# Altium project LT3790.PrjPcb
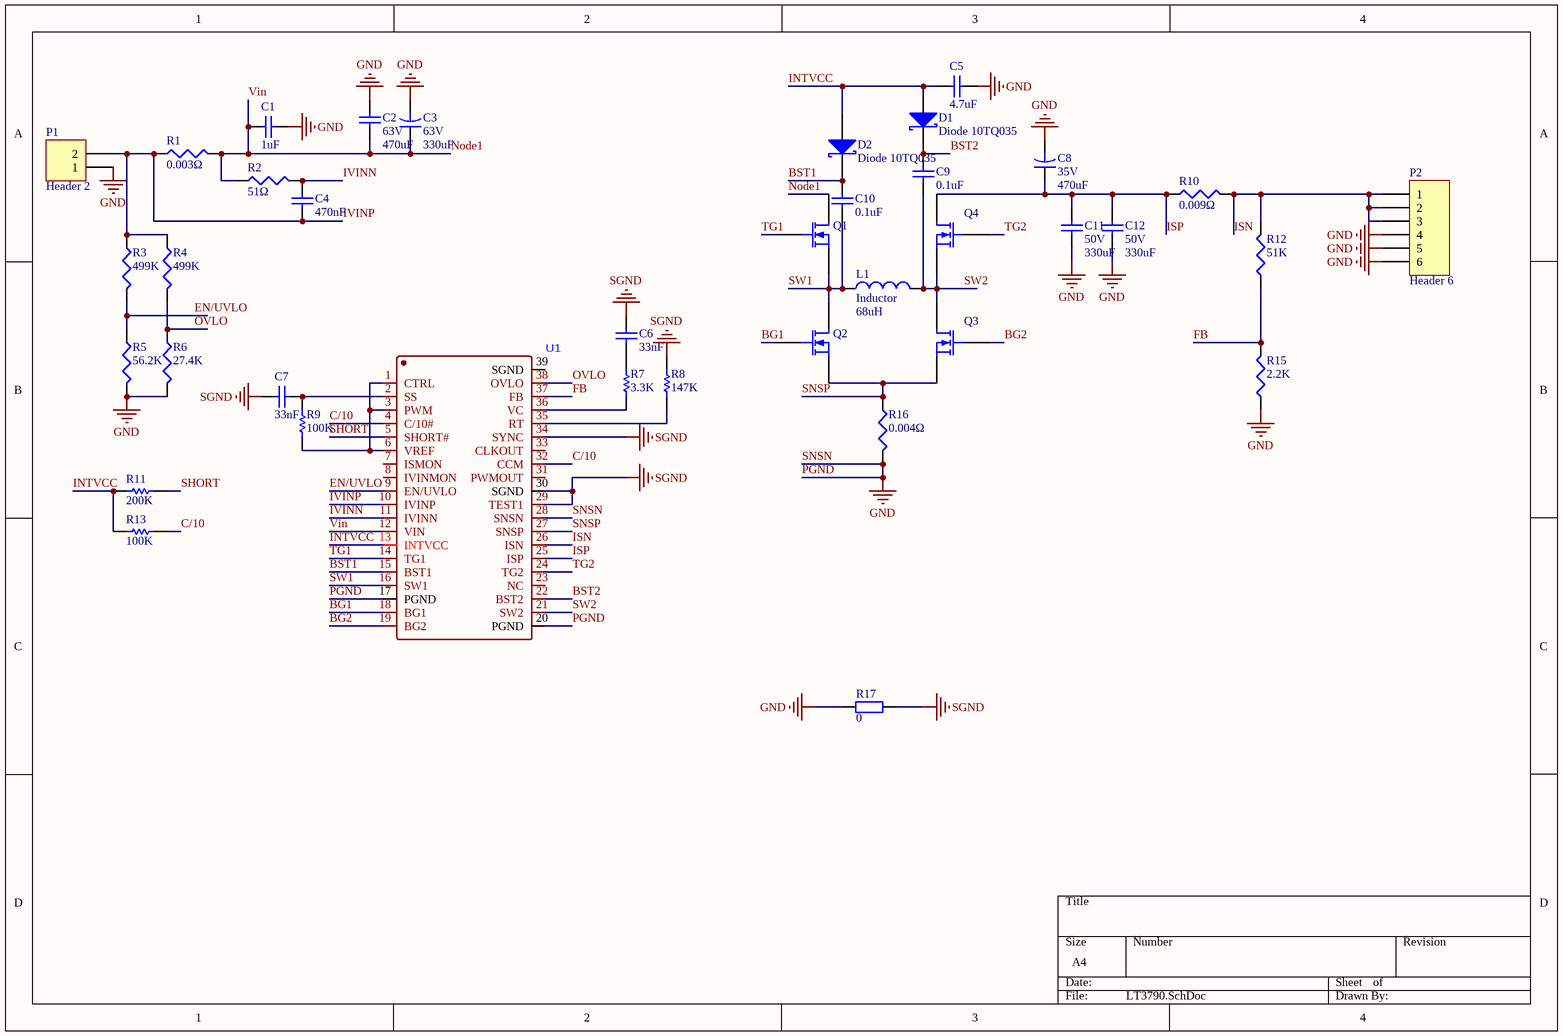
[diagram p0: LT3790.SchDoc]
1 sheet, 38 parts. Net scope: global (net labels, ports and power ports of the same name join across sheets).
Board file: LT3790.PcbDoc

## Sheet LT3790.SchDoc
size A4; SheetNumber: 1; SheetTotal: 1

### Parts
C1  1uF  [CAP0603]
C2  63V  value 470uF  [CAP-SMD_D16xl 16.5mm]
C3  63V  value 330uF  [CAP-SMD_D16xl 16.5mm]
C4  470nF  [cap0402]
C5  4.7uF  [CAP0603]
C6  33nF  [cap0402]
C7  33nF  [cap0402]
C8  35V  value 470uF  [SMD,D10xl10.5mm]
C9  0.1uF  [CAP0603]
C10  0.1uF  [CAP0603]
C11  50V  value 330uF  [CAP-SMD,D10xl10.5mm]
C12  50V  value 330uF  [CAP-SMD,D10xl10.5mm]
D1  Diode 10TQ035  [LED-SMB]
D2  Diode 10TQ035  [LED-SMB]
L1  Inductor  value 68uH  [IND-SMD_L6.0-W6.0]
P1  Header 2  [XT30-M]
P2  Header 6  [HDR-M-2.54_2X3]
Q1  (no value)  [N-mos TO-252]
Q2  (no value)  [N-mos TO-252]
Q3  (no value)  [N-mos TO-252]
Q4  (no value)  [N-mos TO-252]
R1  0.003Ω  [RES2512]
R2  51Ω  [RES0603]
R3  499K  [res0402]
R4  499K  [res0402]
R5  56.2K  [res0402]
R6  27.4K  [res0402]
R7  3.3K  [res0402]
R8  147K  [res0402]
R9  100K  [res0402]
R10  0.009Ω  [RES2512]
R11  200K  [res0402]
R12  51K  [res0402]
R13  100K  [res0402]
R15  2.2K  [res0402]
R16  0.004Ω  [RES2512]
R17  0  [RES0805]
U1  (no value)  [LT3790]

### Nets
PGND: C1.1 C2.2 C3.2 C5.1 C8.2 C11.2 C12.2 P1.1 P2.4 P2.5 P2.6 R5.2 R6.2 R15.1 R16.2 R17.1 U1.17(PGND) U1.20(PGND) U1.28(SNSN)  [also labelled GND, SNSN]
SGND: C6.1 C7.2 R8.1 R17.2 U1.29(TEST1) U1.30(SGND) U1.34(SYNC)
BG1: Q2.2(G) U1.18(BG1)
BG2: Q3.2(G) U1.19(BG2)
BST1: C10.1 D2.1(K) U1.15(BST1)
BST2: C9.1 D1.1(K) U1.22(BST2)
C/10: R13.1 U1.4(C/10#) U1.32(CCM)
EN/UVLO: R3.2 R5.1 U1.9(EN/UVLO)
FB: R12.1 R15.2 U1.37(FB)
INTVCC: C5.2 D1.3(A) D2.3(A) R11.2 R13.2 U1.13(INTVCC)
ISN: P2.1 P2.2 P2.3 R10.2 R12.2 U1.26(ISN)
ISP: C8.1 C11.1 C12.1 Q4.1(D) R10.1 U1.25(ISP)
IVINN: C4.1 R2.2 U1.11(IVINN)
IVINP: C4.2 P1.2 R1.1 R3.1 R4.1 U1.10(IVINP)
Node1: C1.2 C2.1 C3.1 Q1.1(D) R1.2 R2.1 U1.12(VIN)  [also labelled Vin]
OVLO: R4.2 R6.1 U1.38(OVLO)
SHORT: R11.1 U1.5(SHORT#)
SNSP: Q2.3(S) Q3.3(S) R16.1 U1.27(SNSP)
SW1: C10.2 L1.1 Q1.3(S) Q2.1(D) U1.16(SW1)
SW2: C9.2 L1.2 Q3.1(D) Q4.3(S) U1.21(SW2)
TG1: Q1.2(G) U1.14(TG1)
TG2: Q4.2(G) U1.24(TG2)
NetC6_2: C6.2 R7.1
NetC7_1: C7.1 R9.2 U1.2(SS)
NetR7_2: R7.2 U1.36(VC)
NetR8_2: R8.2 U1.35(RT)
NetR9_1: R9.1 U1.1(CTRL) U1.3(PWM) U1.6(VREF)

Not connected (* = marked no-connect by the designer): U1 7(ISMON) 8(IVINMON) 23(NC) 31(PWMOUT) 33(CLKOUT) 39(SGND)

### Library data of the parts
C1 C5 C9 C10 C12 = Cap: 0603; Published: 8-Jun-2000; LatestRevisionDate: 17-Jul-2002; LatestRevisionNote: Re-released for DXP Platform.; PackageReference: RAD-0.3; Publisher: Altium Limited; PackageDescription: Radial Cap, Thru-Hole; 2 Leads; 0.3 in Pin Spacing
C2 = Cap: SMD D16xl; Published: 8-Jun-2000; LatestRevisionDate: 17-Jul-2002; LatestRevisionNote: Re-released for DXP Platform.; PackageReference: RAD-0.3; Publisher: Altium Limited; PackageDescription: Radial Cap, Thru-Hole; 2 Leads; 0.3 in Pin Spacing
C3 = Cap2: SMD,D16xl; Published: 23-Sep-2002; PackageReference: CAPR5-4X5; Publisher: Altium Limited; PackageDescription: Capacitor; 2 Leads
C4 C6 C7 = Cap: 0402; Published: 8-Jun-2000; LatestRevisionDate: 17-Jul-2002; LatestRevisionNote: Re-released for DXP Platform.; PackageReference: RAD-0.3; Publisher: Altium Limited; PackageDescription: Radial Cap, Thru-Hole; 2 Leads; 0.3 in Pin Spacing
C8 = Cap2: RVT470UF35V67RV0056; Published: 23-Sep-2002; PackageReference: CAPR5-4X5; Publisher: Altium Limited; PackageDescription: Capacitor; 2 Leads
C11 = Cap: VHTE1051V331MVTMCG; Published: 8-Jun-2000; LatestRevisionDate: 17-Jul-2002; LatestRevisionNote: Re-released for DXP Platform.; PackageReference: RAD-0.3; Publisher: Altium Limited; PackageDescription: Radial Cap, Thru-Hole; 2 Leads; 0.3 in Pin Spacing
D1 D2 = Diode 10TQ035: SMBJ5340B; Note: Terminal 2 is the TAB and is electrically connected to the cathode; Published: 8-Jun-2000; LatestRevisionDate: 17-Jul-2002; LatestRevisionNote: Re-released for DXP Platform.; DatasheetVersion: PD-2.057B; PackageVersion: Feb-1998; PackageReference: TO-220AC; Publisher: Altium Limited; PackageDescription: TO, Thru-Hole, Vertical, Heatsink Mounted; 3 In-Line Leads (1 Absent); Pitch 2.54 mm; ComponentLink1Description: Manufacturer Link; ComponentLink1URL: http://www.irf.com/; ComponentLink2Description: Datasheet; ComponentLink2URL: http://www.irf.com/product-info/datasheets/data/10tq.pdf
L1 = Inductor: SWPA6045S680MT; Code_IEC: 1005; Published: 8-Jun-2000; LatestRevisionDate: 29-May-2009; LatestRevisionNote: IPC-7351 Footprint Added.; PackageReference: 0402-A; Publisher: Altium Limited; PackageDescription: Chip Inductor; Code_JEITA: 0402
P1 = Header 2: Header, 2-Pin; LatestRevisionDate: 17-Jul-2002; LatestRevisionNote: Re-released for DXP Platform.; Publisher: Altium Limited
P2 = Header 6: Header, 6-Pin; LatestRevisionDate: 17-Jul-2002; LatestRevisionNote: Re-released for DXP Platform.; Publisher: Altium Limited
Q1 = MOSFET-N: SM4132T9RL; Published: 8-Jun-2000; LatestRevisionDate: 17-Jul-2002; LatestRevisionNote: Re-released for DXP Platform.; PackageVersion: 1995/1996; PackageReference: E3; Publisher: Altium Limited; PackageDescription: TO, Flat Index; 3 In-Line, Axial Leads; Body Dia. 4.6mm; Lead Dia. 0.5 mm (max)
Q2-Q4 = MOSFET-N: N-Channel MOSFET; Published: 8-Jun-2000; LatestRevisionDate: 17-Jul-2002; LatestRevisionNote: Re-released for DXP Platform.; PackageVersion: 1995/1996; PackageReference: E3; Publisher: Altium Limited; PackageDescription: TO, Flat Index; 3 In-Line, Axial Leads; Body Dia. 4.6mm; Lead Dia. 0.5 mm (max)
R1 R10 R16 = Res3: 2512; Published: 8-Jun-2000; LatestRevisionDate: 29-May-2009; LatestRevisionNote: IPC-7351 Footprint Added.; PackageReference: J1-0603; Publisher: Altium Limited; PackageDescription: Chip Resistor
R2 = Res3: 0603; Published: 8-Jun-2000; LatestRevisionDate: 29-May-2009; LatestRevisionNote: IPC-7351 Footprint Added.; PackageReference: J1-0603; Publisher: Altium Limited; PackageDescription: Chip Resistor
R3-R6 R12 R15 = Res3: 0402; Published: 8-Jun-2000; LatestRevisionDate: 29-May-2009; LatestRevisionNote: IPC-7351 Footprint Added.; PackageReference: J1-0603; Publisher: Altium Limited; PackageDescription: Chip Resistor
R7-R9 R11 R13 = Res1: 0402; Published: 8-Jun-2000; LatestRevisionDate: 17-Jul-2002; LatestRevisionNote: Re-released for DXP Platform.; PackageReference: AXIAL-0.3; Publisher: Altium Limited; PackageDescription: Axial Device, Thru-Hole; 2 Leads; 0.3 in Pin Spacing
R17 = Res2: 0805; Published: 8-Jun-2000; LatestRevisionDate: 17-Jul-2002; LatestRevisionNote: Re-released for DXP Platform.; PackageReference: AXIAL-0.4; Publisher: Altium Limited; PackageDescription: Axial Device, Thru-Hole; 2 Leads; 0.4 in Pin Spacing
U1 = LT3790EFE#PBF